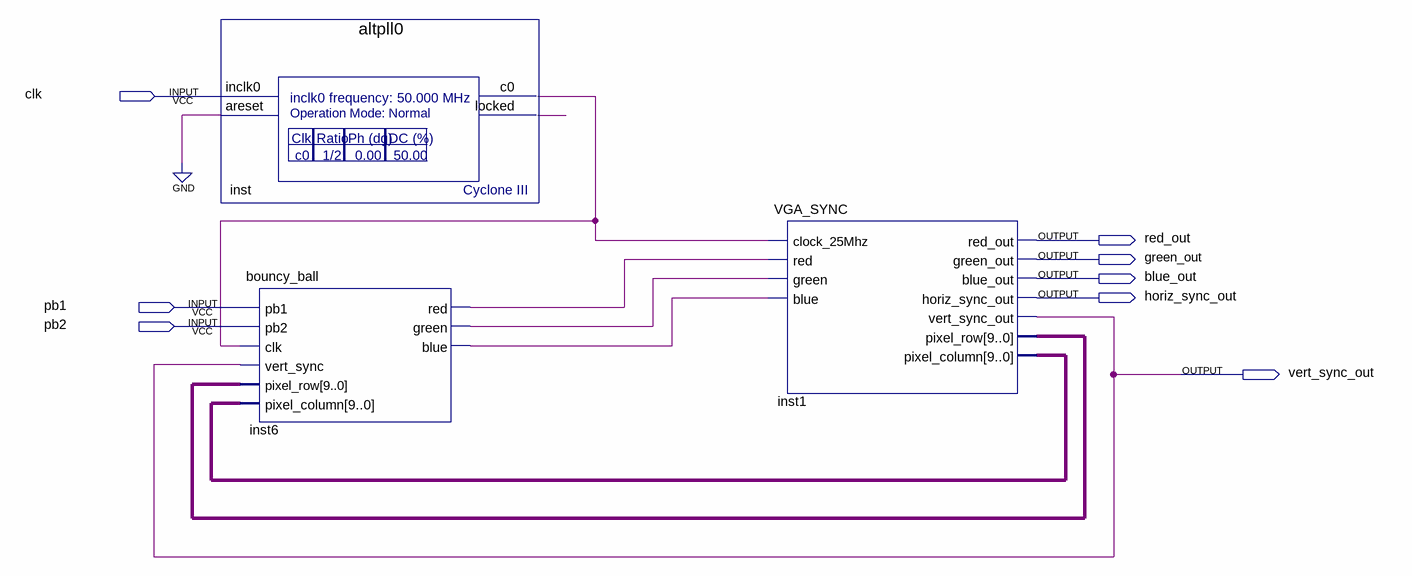
[diagram p0: schematic sheet]
// Quartus schematic VGAExample.bdf as structural Verilog: 3 symbols, 8 pins
module VGAExample (
  input  clk,
  input  pb1,
  input  pb2,
  output red_out,
  output green_out,
  output blue_out,
  output horiz_sync_out,
  output vert_sync_out
);

  wire inst6_blue, inst6_green, inst6_red, inst_c0, inst_locked;
  wire [9:0] inst1_pixel_column, inst1_pixel_row;

  altpll0 inst (.inclk0(clk), .areset(1'b0), .c0(inst_c0), .locked(inst_locked));
  bouncy_ball inst6 (
    .pb1(pb1), .pb2(pb2), .clk(inst_c0), .vert_sync(vert_sync_out), .pixel_row(inst1_pixel_row),
    .pixel_column(inst1_pixel_column), .red(inst6_red), .green(inst6_green), .blue(inst6_blue));
  VGA_SYNC inst1 (
    .clock_25Mhz(inst_c0), .red(inst6_red), .green(inst6_green), .blue(inst6_blue), .red_out(red_out),
    .green_out(green_out), .blue_out(blue_out), .horiz_sync_out(horiz_sync_out),
    .vert_sync_out(vert_sync_out), .pixel_row(inst1_pixel_row), .pixel_column(inst1_pixel_column));
endmodule
